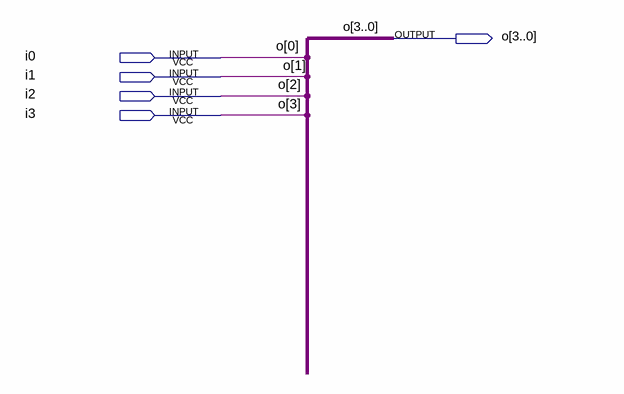
[diagram p0: schematic sheet]
// Quartus schematic t4line_to_4bus.bdf as structural Verilog: 0 symbols, 5 pins
module t4line_to_4bus (
  input  i0,
  input  i1,
  input  i2,
  input  i3,
  output [3:0] o
);


  assign o = {i3, i2, i1, i0};
endmodule
